# EAGLE design mcp1642b (EAGLE 9.0.0)
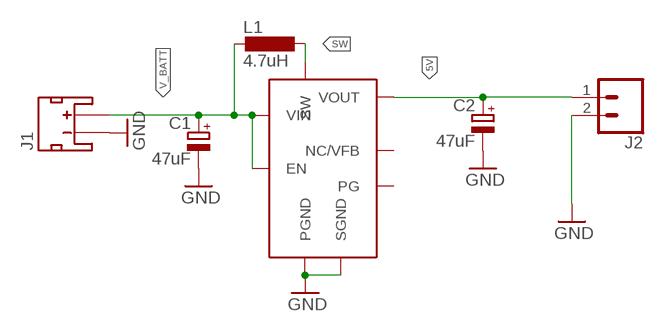
[diagram p0: schematic, sheet 1]

## Parts
C1  47uF  CPOL-EU153CLV-0505  [153CLV-0505]
C2  47uF  CPOL-EU153CLV-0505  [153CLV-0505]
J1  JST_2MM_MALE  [JST-2-SMD]
J2  CONN_02PTH4  [1X02_XTRA_BIG]
L1  4.7uH  L-EUWE-TPC  [POWER-CHOKE_WE-TPC]
U11  MCP1642B  [MCP1642B]

## Nets
5V: C2.+ J2.1 U11.VOUT
GND: C1.- C2.- J1.1(-) J2.2 U11.PGND U11.SGND
SW: L1.1 U11.SW
V_BATT: C1.+ J1.2(+) L1.2 U11.EN U11.VIN
Unconnected: J1.NC1(PAD1) J1.NC2(PAD2) U11.NC(NC/VFB) U11.PG

## Library data of the parts
C1 C2 = rcl:CPOL-EU: POLARIZED CAPACITOR, European symbol; SPICEPREFIX: C
J1 = SparkFun-Connectors:JST_2MM_MALE: JST 2MM MALE RA CONNECTOR Two pin, compact surface mount connector. Commonly used as a battery input connection point. We really like the solid locking feeling and high current rating on these small connectors. We use these all the time as battery connectors. Mates to single-cell LiPo batteries. Here is the connector we sell at SparkFun: JST Right Angle Connector - White <https://www.sparkfun.com/products/8612> (PRT-08612) Datasheet <http://www.sparkfun.com/datasheets/Prototyping/Connectors/JST-Horizontal.pdf> It was used on these SparkFun products: SparkFun MOSFET Power Controller <https://www.sparkfun.com/products/11214> (PRT-11214) SparkFun Battery Babysitter - LiPo Battery Manager <https://www.sparkfun.com/products/13777> (PRT-13777) And many, many others that required a lipo battery connection.; PROD_ID: CONN-11443; SF_ID: PRT-08612
J2 = SparkFun-Connectors:CONN_02: Multi connection point. Often used as Generic Header-pin footprint for 0.1 inch spaced/style header connections On any of the 0.1 inch spaced packages, you can populate with these: Break Away Headers - Straight <https://www.sparkfun.com/products/116> (PRT-00116) Break Away Male Headers - Right Angle <https://www.sparkfun.com/products/553> (PRT-00553) Female Headers <https://www.sparkfun.com/products/115> (PRT-00115) Break Away Headers - Machine Pin <https://www.sparkfun.com/products/117> (PRT-00117) Break Away Female Headers - Swiss Machine Pin <https://www.sparkfun.com/products/743> (PRT-00743) For SCREWTERMINALS and SPRING TERMINALS visit here: Screw Terimnals on SparkFun.com <https://www.sparkfun.com/search/results?term=Screw+Terminals> (5mm/3.5mm/2.54mm spacing) This device is also useful as a general connection point to wire up your design to another part of your project. Our various solder wires solder well into these plated through hole pads. Hook-Up Wire - Assortment (Stranded, 22 AWG) <https://www.sparkfun.com/products/11375> (PRT-11375) Hook-Up Wire - Assortment (Solid Core, 22 AWG) <https://www.sparkfun.com/products/11367> (PRT-11367) View the entire wire category on our website here <https://www.sparkfun.com/categories/141> Special notes: Molex polarized connector foot print use with: PRT-08233 with associated crimp pins and housings. 2.54_SCREWTERM for use with PRT-10571. 3.5mm Screw Terminal footprints for PRT-08084 5mm Screw Terminal footprints for use with PRT-08432
L1 = rcl:L-EU: INDUCTOR, European symbol; SPICEPREFIX: L
U11 = MCP1642B:MCP1642B

## Board
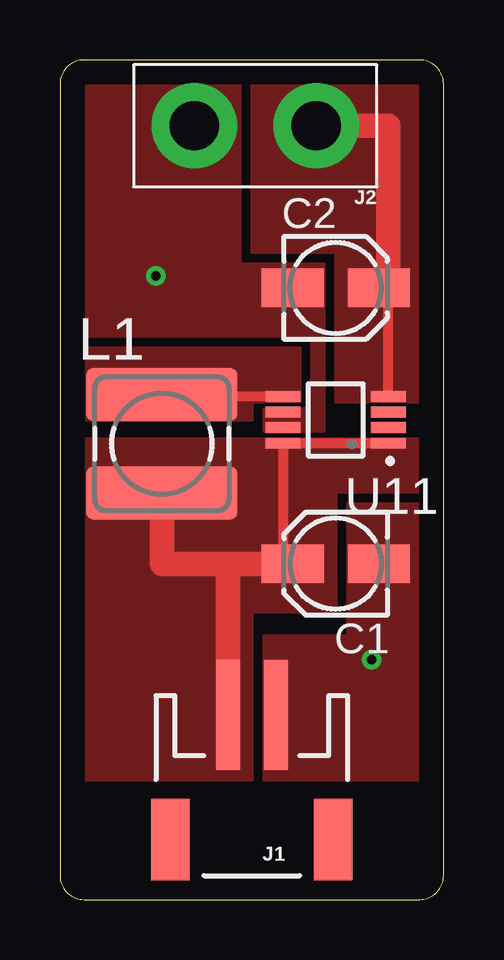
[diagram p1: board, top side]
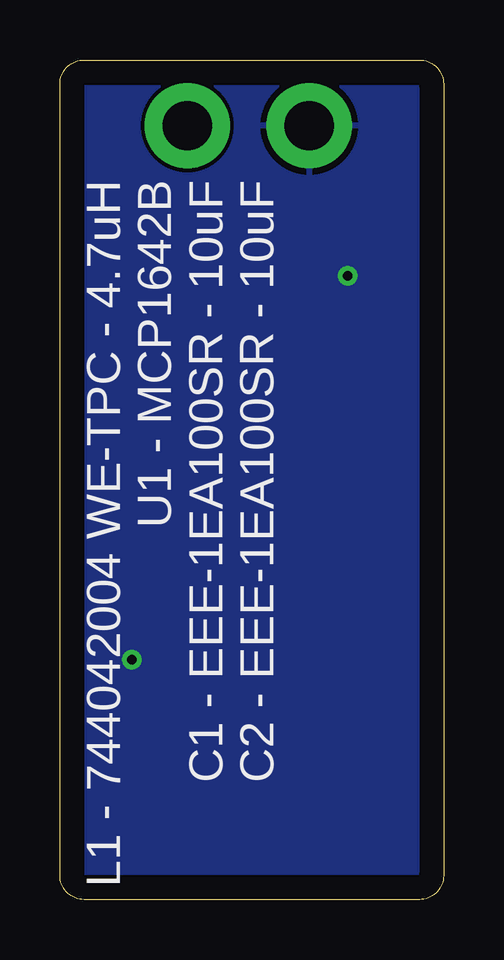
[diagram p2: board, bottom side, seen from below]

Size 16 x 35 mm. Coordinates in mm from the lower left corner, seen from the top.
Outline: 0,34 0,1 arc90 1,0 15,0 arc90 16,1 16,34 arc90 15,35 1,35 arc90 0,34
Copper layers (1*16): Top 0.035mm / dielectric 1.5mm / Bottom 0.035mm
Design rules "default": minimum track width 6mil, minimum drill 0.35mm, track to track 6mil, track to pad 6mil, pad to pad 6mil, via to via 6mil, smd to smd 6mil, copper to edge 40mil, drill to drill 6mil, minimum pad ring 10mil, minimum via ring 8mil, stop-mask expansion 4mil, vias tented up to drill 0mil, thermal gap 10mil

### Footprints (pad centres in the part's own frame; a part is rotated, then mirrored left to right if it is on the bottom)
153CLV-0405 = smd 2.6 x 1.6: + 1.8,0; - -1.8,0
JST-2-SMD = smd 1 x 4.6: 1 -1,-3.7; 2 1,-3.7 | smd 1.6 x 3.4: NC1 -3.4,1.5; NC2 3.4,1.5
1X02_XTRA_BIG = drill 2.057 pad 3.556: 1 -2.54,0; 2 2.54,0
POWER-CHOKE_WE-TPC = smd 6.3 x 2.2: 1 0,2.05; 2 0,-2.05
MCP1642B = smd 1.45 x 0.45: EN -2.2,0.975; NC -2.2,0.325; PG -2.2,-0.325; PGND 2.2,-0.325; SGND 2.2,0.325; SW 2.2,-0.975; VIN 2.2,0.975; VOUT -2.2,-0.975

### Placement (x,y rotation side)
C1  10uF  [153CLV-0405]  11.5,14 180 top
C2  10uF  [153CLV-0405]  11.5,25.5 0 top
J1  8,4 180 top
J2  8.14,32.26 180 top
L1  4.25,19 0 top
U11  11.5,20 180 top

### Tracks (layer width: path | path; a pad name or v marks a point on that pad's centre or on a via)
5V
  Top 0.406: U11.VOUT 13.7,25.5 C2.+
  Top 1.016: J2.1 13.7,32.26 13.7,25.5
  pour Top (no thermals): 16,20.75 11.5,20.75 11.5,27 8,27 8,35 16,35
GND  (via drill 0.4)
  other vias: 4,26 13,10
  pour Bottom: 0,35 16,35 16,0 0,0
  pour Top (no thermals): 8.5,20.45 8.5,19.52 11,19.52 11,26.5 7.5,26.5 7.5,34 0,34 0,23.5 10.5,23.5 10.5,20.45
  pour Top (no thermals): 16,5 8.5,5 8.5,11 12,11 12,16.5 16,16.5
SW
  Top 0.406: U11.SW 4.33,20.98 L1.1
  pour Top (no thermals): 0,20 8,20 8,20.75 10,20.75 10,23 0,23
V_BATT
  Top 0.406: U11.EN U11.VIN 9.3,14 C1.+
  Top 1.016: J1.2 7,14 | 7,14 C1.+ | L1.2 4.25,14 7,14
  pour Top (no thermals): 0,5 8,5 8,12 11.5,12 11.5,17 16,17 16,19.2 0,19.2

### Text on the board
bNames: L1 - 744042004 WE-TPC - 4.7uH / U1 - MCP1642B / C1 - EEE-1EA100SR - 10uF / C2 - EEE-1EA100SR - 10uF